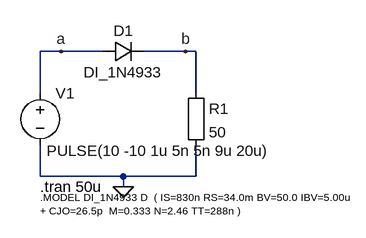
[diagram p0: schematic trr_1n4933.asc]
trr_1n4933.asc, the LTspice schematic file:
Version 4
SHEET 1 880 680
WIRE -176 128 -208 128
WIRE -112 128 -176 128
WIRE 16 128 -48 128
WIRE 32 128 16 128
WIRE -208 192 -208 128
WIRE 32 192 32 128
WIRE -208 320 -208 272
WIRE -80 320 -208 320
WIRE 32 320 32 272
WIRE 32 320 -80 320
WIRE -80 336 -80 320
FLAG -80 336 0
FLAG -176 128 a
FLAG 16 128 b
SYMBOL diode -112 144 R270
WINDOW 0 32 32 VTop 2
WINDOW 3 0 32 VBottom 2
SYMATTR InstName D1
SYMATTR Value DI_1N4933
SYMBOL Misc\\EuropeanResistor 16 176 R0
SYMATTR InstName R1
SYMATTR Value 50
SYMBOL voltage -208 176 R0
WINDOW 3 10 105 Left 2
WINDOW 123 0 0 Left 2
WINDOW 39 0 0 Left 2
SYMATTR InstName V1
SYMATTR Value PULSE(10 -10 1u 5n 5n 9u 20u)
TEXT -208 336 Left 2 !.tran 50u
TEXT -208 352 Left 1 !.MODEL DI_1N4933 D  ( IS=830n RS=34.0m BV=50.0 IBV=5.00u\n+ CJO=26.5p  M=0.333 N=2.46 TT=288n )

The netlist it stands for:
* trr_1n4933.asc
D1 a b DI_1N4933
R1 b 0 50
V1 a 0 PULSE(10 -10 1u 5n 5n 9u 20u)
.model D D
.lib standard.dio
.tran 50u
.MODEL DI_1N4933 D  ( IS=830n RS=34.0m BV=50.0 IBV=5.00u
+ CJO=26.5p  M=0.333 N=2.46 TT=288n )
.backanno
.end